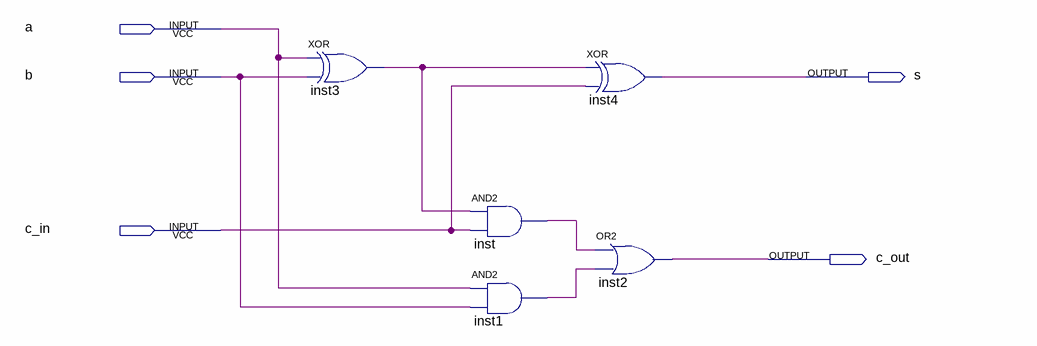
[diagram p0: schematic sheet]
// Quartus schematic FA.bdf as structural Verilog: 5 symbols, 5 pins
module FA (
  input  a,
  input  b,
  input  c_in,
  output s,
  output c_out
);

  wire inst1_out, inst3_out, inst_out;

  xor inst3 (inst3_out, a, b);
  and inst (inst_out, inst3_out, c_in);
  and inst1 (inst1_out, a, b);
  xor inst4 (s, inst3_out, c_in);
  or inst2 (c_out, inst_out, inst1_out);
endmodule
